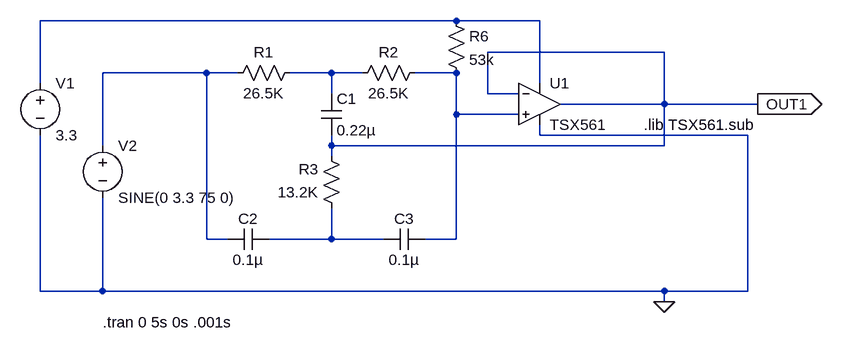
[diagram p0: schematic ECGACTNTCHBFR.asc]
ECGACTNTCHBFR.asc, the LTspice schematic file:
Version 4
SHEET 1 880 680
WIRE -112 0 -752 0
WIRE 16 0 -112 0
WIRE 208 48 -64 48
WIRE -496 80 -656 80
WIRE -448 80 -496 80
WIRE -304 80 -368 80
WIRE -256 80 -304 80
WIRE -112 80 -176 80
WIRE -752 96 -752 0
WIRE 16 96 16 0
WIRE -304 112 -304 80
WIRE -64 112 -64 48
WIRE -16 112 -64 112
WIRE 208 128 208 48
WIRE 208 128 48 128
WIRE 352 128 208 128
WIRE -112 144 -112 80
WIRE -16 144 -112 144
WIRE 16 176 16 160
WIRE 336 176 16 176
WIRE -656 192 -656 80
WIRE -304 192 -304 176
WIRE 208 192 208 128
WIRE 208 192 -304 192
WIRE -304 208 -304 192
WIRE -496 336 -496 80
WIRE -464 336 -496 336
WIRE -304 336 -304 288
WIRE -304 336 -400 336
WIRE -224 336 -304 336
WIRE -112 336 -112 144
WIRE -112 336 -160 336
WIRE -752 416 -752 176
WIRE -656 416 -656 272
WIRE -656 416 -752 416
WIRE 208 416 -656 416
WIRE 336 416 336 176
WIRE 336 416 208 416
WIRE 208 432 208 416
FLAG 208 432 0
FLAG 352 128 OUT1
IOPIN 352 128 Out
SYMBOL Opamps\\opamp2 16 64 R0
SYMATTR InstName U1
SYMATTR Value TSX561
SYMBOL res -352 64 R90
WINDOW 0 0 56 VBottom 2
WINDOW 3 32 56 VTop 2
SYMATTR InstName R1
SYMATTR Value 26.5K
SYMATTR SpiceLine tol=1%
SYMBOL res -160 64 R90
WINDOW 0 0 56 VBottom 2
WINDOW 3 32 56 VTop 2
SYMATTR InstName R2
SYMATTR Value 26.5K
SYMATTR SpiceLine tol=1%
SYMBOL res -288 304 R180
WINDOW 0 36 76 Left 2
WINDOW 3 36 40 Left 2
SYMATTR InstName R3
SYMATTR Value 13.2K
SYMBOL cap -320 112 R0
SYMATTR InstName C1
SYMATTR Value 0.22µ
SYMBOL cap -400 320 R90
WINDOW 0 0 32 VBottom 2
WINDOW 3 32 32 VTop 2
SYMATTR InstName C2
SYMATTR Value 0.1µ
SYMBOL cap -160 320 R90
WINDOW 0 0 32 VBottom 2
WINDOW 3 32 32 VTop 2
SYMATTR InstName C3
SYMATTR Value 0.1µ
SYMBOL voltage -752 80 R0
WINDOW 123 0 0 Left 2
WINDOW 39 0 0 Left 2
SYMATTR InstName V1
SYMATTR Value 3.3
SYMBOL voltage -656 176 R0
WINDOW 123 0 0 Left 2
WINDOW 39 0 0 Left 2
SYMATTR InstName V2
SYMATTR Value SINE(0 3.3 75 0)
SYMBOL res -128 -16 R0
SYMATTR InstName R6
SYMATTR Value 53k
SYMATTR SpiceLine tol=1%
TEXT 176 160 Left 2 !.lib TSX561.sub
TEXT -656 464 Left 2 !.tran 0 5s 0s .001s

The netlist it stands for:
* ECGACTNTCHBFR.asc
XU1 N004 OUT1 N001 0 OUT1 TSX561  ; pins In+ In- V+ V- OUT
R1 N003 N002 26.5K tol=1%
R2 N004 N003 26.5K tol=1%
R3 N005 OUT1 13.2K
C1 N003 OUT1 0.22µ
C2 N005 N002 0.1µ
C3 N004 N005 0.1µ
V1 N001 0 3.3
V2 N002 0 SINE(0 3.3 75 0)
R6 N001 N004 53k tol=1%
.lib TSX561.sub
.tran 0 5s 0s .001s
.backanno
.end